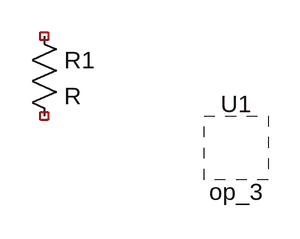
[diagram p0: schematic op_mit_macromodell.asc]
op_mit_macromodell.asc, the LTspice schematic file:
Version 4
SHEET 1 880 680
SYMBOL EIT_Semiconductors\\op_3 224 176 R0
SYMATTR InstName U1
SYMBOL res 16 48 R0
SYMATTR InstName R1

The netlist it stands for:
* op_mit_macromodell.asc
* U1: op_3 (symbol EIT_Semiconductors\op_3 not available, pin order unknown); nets seen at it: 
R1 NC_01 NC_02 R
.backanno
.end